# EasyEDA Pro project STC15W4K56S4_2025-01-08_21-36-35.eprj, board PCB3
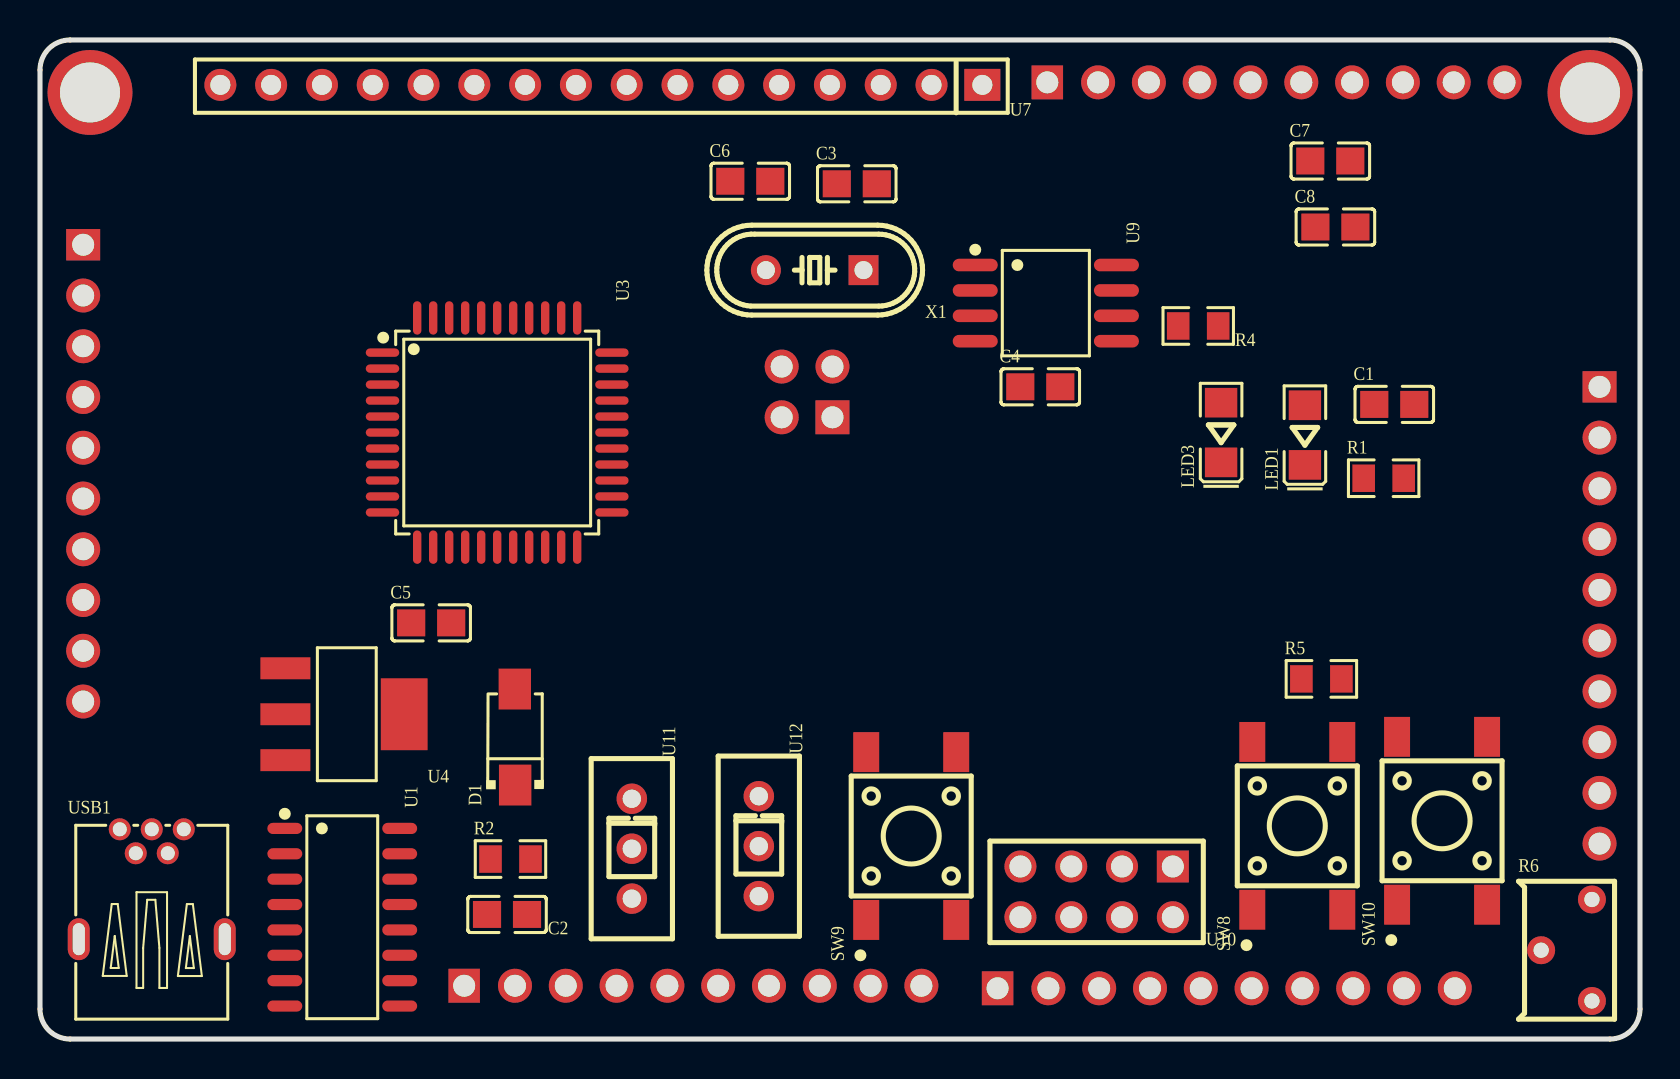
[diagram p4: board, top side]
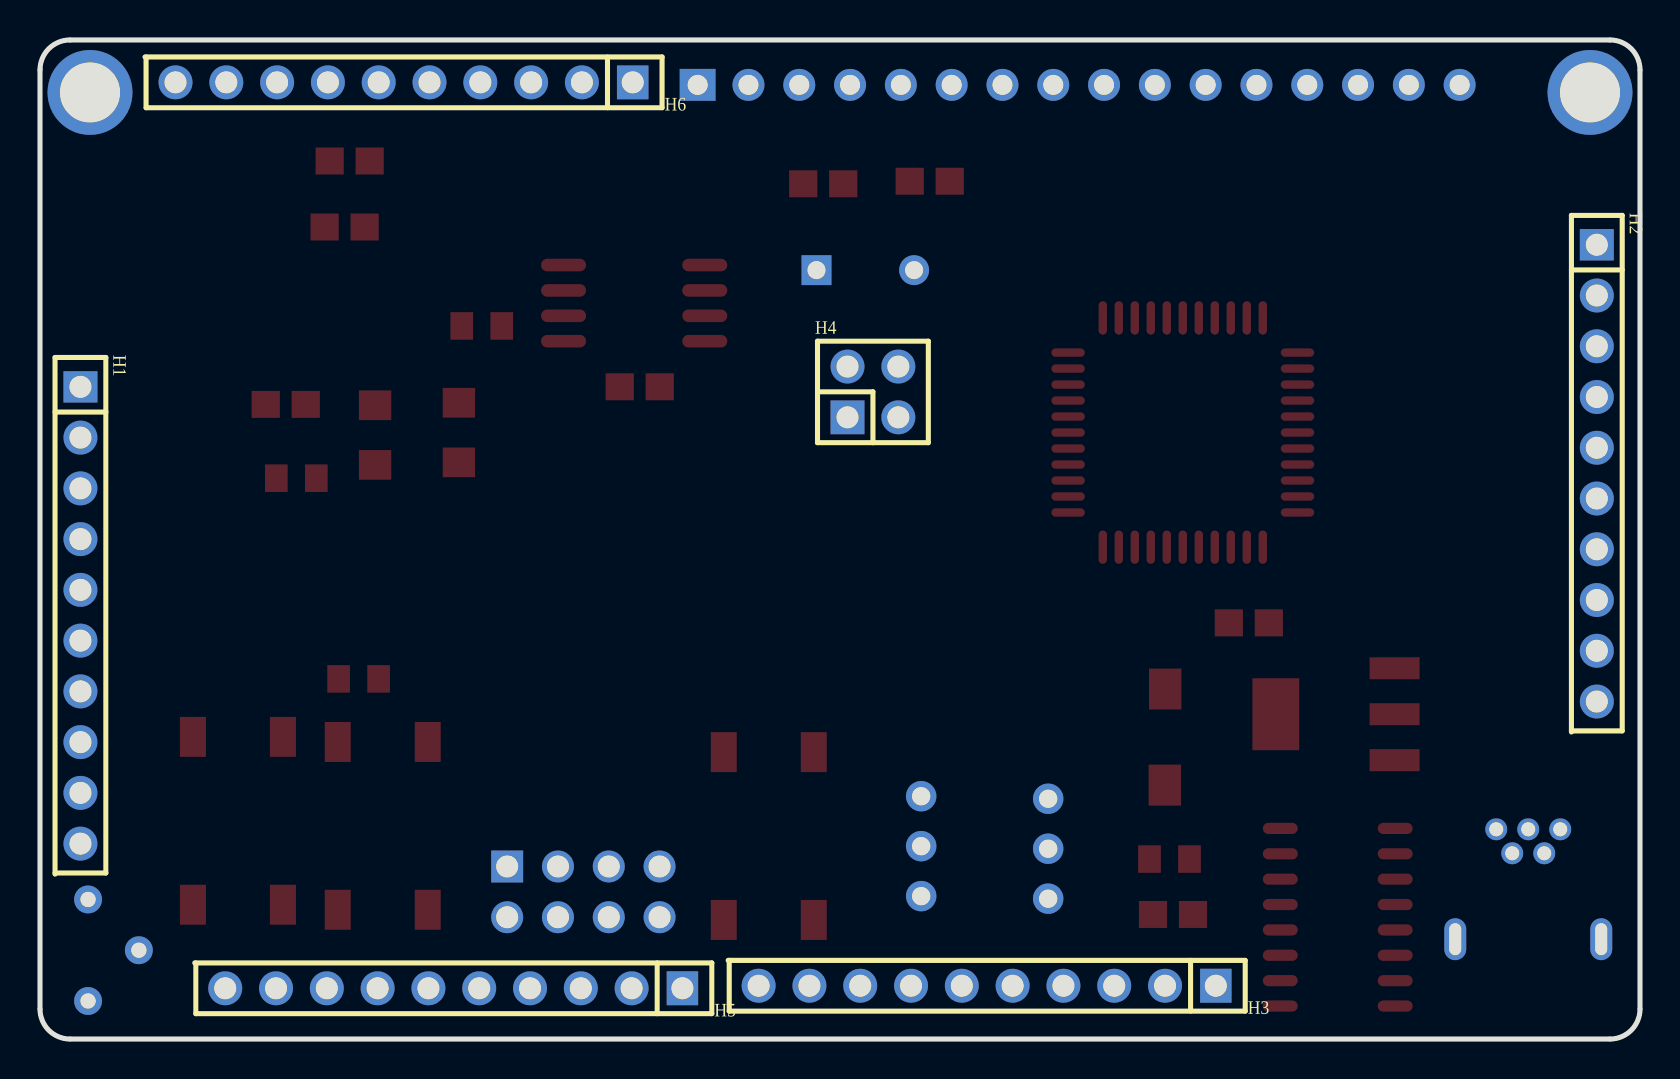
[diagram p5: board, bottom side, seen from below]

Outline 80 x 50 mm; copper layers: Top Layer, Bottom Layer. Coordinates in mm from the lower left corner of the outline.
Outline path: 0,48.5 0,1.5 arc(0.44,0.44) 1.5,0 78.5,0 arc(79.56,0.44) 80,1.5 80,48.5 arc(79.56,49.56) 78.5,50 1.5,50 arc(0.44,49.56) 0,48.5
Stack: Top Layer 0.035mm / Dielectric1 1.51mm FR4 er 4.5 / Bottom Layer 0.035mm

## Design rules (mm)
template: JLCPCB Capability(Two Layers Board)
spacing copperThickness1oz (default): track to track 0.102, other pairs 0.152 to 0.3
spacing copperThickness2oz: track to track 0.203, other pairs 0.152 to 0.3
track width copperThickness1oz (default): min 0.127, default 0.254, max 2.54
track width copperThickness2oz: min 0.203, default 0.254, max 2.54
differential pair differentialPair (default): width min 0.127, default 0.254, max 2.54; gap min 0.152, default 0.152
via viaSize (default): diameter min 0.5, default 0.61, max 10; hole min 0.3, default 0.305, max 6.3

## Placement (name value [footprint] x y rotation side)
C1  100nF  [C0805]  67.71 31.76 0 top
C2  10nF  [C0805]  23.35 6.23 180 top
C3  30pF  [C0805]  40.84 42.8 0 top
C4  47uF  [C0805]  50.01 32.64 0 top
C5  10nF  [C0805]  19.56 20.83 0 top
C6  30pF  [C0805]  35.51 42.93 0 top
C7  100nF  [C0805]  64.52 43.94 0 top
C8  100nF  [C0805]  64.77 40.64 0 top
D1  SS12  [SMA_L4.3-W2.6-LS5.0-RD]  23.75 15.11 90 top
H1  2.54-1*10  [HDR-TH_10P-P2.54-V-M]  77.98 21.21 270 bottom
H2  2.54-1*10  [HDR-TH_10P-P2.54-V-M]  2.16 28.32 270 bottom
H3  2.54-1*10  [HDR-TH_10P-P2.54-V-M]  32.64 2.67 0 bottom
H4  PZ254V-12-4P  [HDR-TH_4P-P2.54-V-M-R2-C2-S2.54]  38.35 32.38 180 bottom
H5  2.54-1*10  [HDR-TH_10P-P2.54-V-M]  59.31 2.54 0 bottom
H6  2.54-1*10  [HDR-TH_10P-P2.54-V-M]  61.79 47.88 0 bottom
LED1  XL-3216SURC  [LED1206-R-RD_RED]  63.25 30.23 90 top
LED3  XL-3216SURC  [LED1206-R-RD_RED]  59.06 30.35 90 top
NOREF  -  [Pad_e42]  77.5 47.37 0 top
NOREF#2  -  [Pad_e39]  2.5 47.37 0 top
R1  10kΩ  [R0805]  67.18 28.07 0 top
R2  300Ω  [R0805]  23.52 9.01 0 top
R4  10kΩ  [R0805]  57.91 35.69 180 top
R5  4.7kΩ  [R0805]  64.07 18.02 0 top
R6  10kΩ  [RES-ADJ-TH_3P-L7.1-W6.9-P2.50-BL-BS]  76.33 4.44 270 top
SW8  KH-6X6X6H-STM  [SW-SMD_4P-L6.0-W6.0-P4.50-LS9.0-3]  62.87 10.67 90 top
SW9  KH-6X6X6H-STM  [SW-SMD_4P-L6.0-W6.0-P4.50-LS9.0-3]  43.56 10.16 90 top
SW10  KH-6X6X6H-STM  [SW-SMD_4P-L6.0-W6.0-P4.50-LS9.0-3]  70.1 10.92 90 top
U1  CH340C  [SOP-16_L10.0-W3.9-P1.27-LS6.0-BL]  15.11 6.1 270 top
U3  STC15W4K56S4-30I-LQFP44  [LQFP-44_L10.0-W10.0-P0.80-LS12.0-BL]  22.86 30.35 270 top
U4  AMS1117-3.3  [SOT-223-3_L6.5-W3.4-P2.30-LS7.0-BR]  15.24 16.26 180 top
U7  PM254-1-16-Z-8.5  [HDR-TH_16P-P2.54-V-F-A]  28.07 47.75 180 top
U9  W25Q64JVSSIQ  [SOIC-8_L5.3-W5.3-P1.27-LS8.0-BL]  50.29 36.83 270 top
U10  2.54-2*4  [HDR-TH_8P-P2.54-V-F-R2-C4-S2.54]  52.83 7.37 180 top
U11  SS-12D00-G3  [SW-TH_3P-L8.8-W3.9-P2.50_SS12D00G3]  29.59 9.52 270 top
U12  SS-12D00-G3  [SW-TH_3P-L8.8-W3.9-P2.50_SS12D00G3]  35.94 9.65 270 top
USB1  U-M-M5DW-W-1  [MINI-USB-TH_U-M-M5DW-W-1]  5.59 7.75 0 top
X1  24MHz  [HC-49US_L11.5-W4.5-P4.88]  38.74 38.48 180 top

## Footprints (pads in the part's own frame, mm; a bottom-side part is the same pattern mirrored in y, then rotated)
C0805
  rect 1.41x1.35 smd: 1(-1,0) 2(1,0)
HC-49US_L11.5-W4.5-P4.88
  rect 1.5x1.5 hole 0.9: 1(-2.44,0)
  round 1.5 hole 0.9: 2(2.44,0)
HDR-TH_4P-P2.54-V-M-R2-C2-S2.54
  rect 1.7x1.7 hole 1.1: 1(-1.27,-1.27)
  round 1.7 hole 1.1: 2(-1.27,1.27) 3(1.27,-1.27) 4(1.27,1.27)
HDR-TH_8P-P2.54-V-F-R2-C4-S2.54
  rect 1.6x1.6 hole 1.1: 1(-3.81,-1.27)
  round 1.6 hole 1.1: 2(-3.81,1.27) 3(-1.27,-1.27) 4(-1.27,1.27) 5(1.27,-1.27) 6(1.27,1.27) 7(3.81,-1.27) 8(3.81,1.27)
HDR-TH_10P-P2.54-V-M
  rect 1.575x1.7 hole 1.1: 1(-11.43,0)
  round 1.7 hole 1.1: 2(-8.89,0) 3(-6.35,0) 4(-3.81,0) 5(-1.27,0) 6(1.27,0) 7(3.81,0) 8(6.35,0) 9(8.89,0) 10(11.43,0)
HDR-TH_16P-P2.54-V-F-A
  rect 1.8x1.6 hole 1: 1(-19.05,0)
  round 1.6 hole 1: 2(-16.51,0) 3(-13.97,0) 4(-11.43,0) 5(-8.89,0) 6(-6.35,0) 7(-3.81,0) 8(-1.27,0) 9(1.27,0) 10(3.81,0) 11(6.35,0) 12(8.89,0) 13(11.43,0) 14(13.97,0) 15(16.51,0) 16(19.05,0)
LED1206-R-RD_RED
  rect 1.485x1.62 smd: 1(1.492,0) 2(-1.492,0)
LQFP-44_L10.0-W10.0-P0.80-LS12.0-BL
  oval 0.42x1.67 smd: 1(-4,-5.735) 2(-3.2,-5.735) 3(-2.4,-5.735) 4(-1.6,-5.735) 5(-0.8,-5.735) 6(0,-5.735) 7(0.8,-5.735) 8(1.6,-5.735) 9(2.4,-5.735) 10(3.2,-5.735) 11(4,-5.735) 23(4,5.735) 24(3.2,5.735) 25(2.4,5.735) 26(1.6,5.735) 27(0.8,5.735) 28(0,5.735) 29(-0.8,5.735) 30(-1.6,5.735) 31(-2.4,5.735) 32(-3.2,5.735) 33(-4,5.735)
  oval 1.67x0.42 smd: 12(5.735,-4) 13(5.735,-3.2) 14(5.735,-2.4) 15(5.735,-1.6) 16(5.735,-0.8) 17(5.735,0) 18(5.735,0.8) 19(5.735,1.6) 20(5.735,2.4) 21(5.735,3.2) 22(5.735,4) 34(-5.735,4) 35(-5.735,3.2) 36(-5.735,2.4) 37(-5.735,1.6) 38(-5.735,0.8) 39(-5.735,0) 40(-5.735,-0.8) 41(-5.735,-1.6) 42(-5.735,-2.4) 43(-5.735,-3.2) 44(-5.735,-4)
MINI-USB-TH_U-M-M5DW-W-1
  round 1.1 hole 0.7: 1(-1.6,2.75) 2(-0.8,1.55) 3(0,2.75) 4(0.8,1.55) 5(1.6,2.75)
  oval 1.1x2.1 hole 0.6x1.6: 6(-3.65,-2.75) 7(3.65,-2.75)
Pad_e39
  round 4.25 hole 3: 1(0,0)
Pad_e42
  round 4.25 hole 3: 1(0,0)
R0805
  rect 1.133x1.377 smd: 1(-1,0) 2(1,0)
RES-ADJ-TH_3P-L7.1-W6.9-P2.50-BL-BS
  round 1.4 hole 0.762: 1(2.54,1.27) 2(0,-1.27) 3(-2.54,1.27)
SMA_L4.3-W2.6-LS5.0-RD
  rect 2.046x1.62 smd: 1(-2.404,-0.009) 2(2.404,0.009)
SOIC-8_L5.3-W5.3-P1.27-LS8.0-BL
  oval 0.63x2.25 smd: 1(-1.905,-3.53) 2(-0.635,-3.53) 3(0.635,-3.53) 4(1.905,-3.53) 5(1.905,3.53) 6(0.635,3.53) 7(-0.635,3.53) 8(-1.905,3.53)
SOP-16_L10.0-W3.9-P1.27-LS6.0-BL
  oval 0.56x1.745 smd: 1(-4.445,-2.873) 2(-3.175,-2.873) 3(-1.905,-2.873) 4(-0.635,-2.873) 5(0.635,-2.873) 6(1.905,-2.873) 7(3.175,-2.873) 8(4.445,-2.873) 9(4.445,2.873) 10(3.175,2.873) 11(1.905,2.873) 12(0.635,2.873) 13(-0.635,2.873) 14(-1.905,2.873) 15(-3.175,2.873) 16(-4.445,2.873)
SOT-223-3_L6.5-W3.4-P2.30-LS7.0-BR
  rect 2.5x1.1 smd: 1(2.97,-2.3) 2(2.97,0) 3(2.97,2.3)
  rect 2.34x3.6 smd: 4(-2.97,0)
SW-SMD_4P-L6.0-W6.0-P4.50-LS9.0-3
  rect 2x1.3 smd: 1(-4.2,2.25) 2(4.2,2.25) 3(-4.2,-2.25) 4(4.2,-2.25)
SW-TH_3P-L8.8-W3.9-P2.50_SS12D00G3
  round 1.524 hole 0.914: 1(-2.5,0) 2(0,0) 3(2.5,0)

## Nets
As in the schematic.

Pads without a net: NOREF 1; NOREF#2 1; SW8 2 3; SW9 1 4; SW10 1 4; U1 7 8 9 10 11 12 13 14 15; U4 4; U10 4 5 6; U11 3; USB1 4
